# EAGLE schematic Logic PCB v14 (EAGLE 9.7.0)
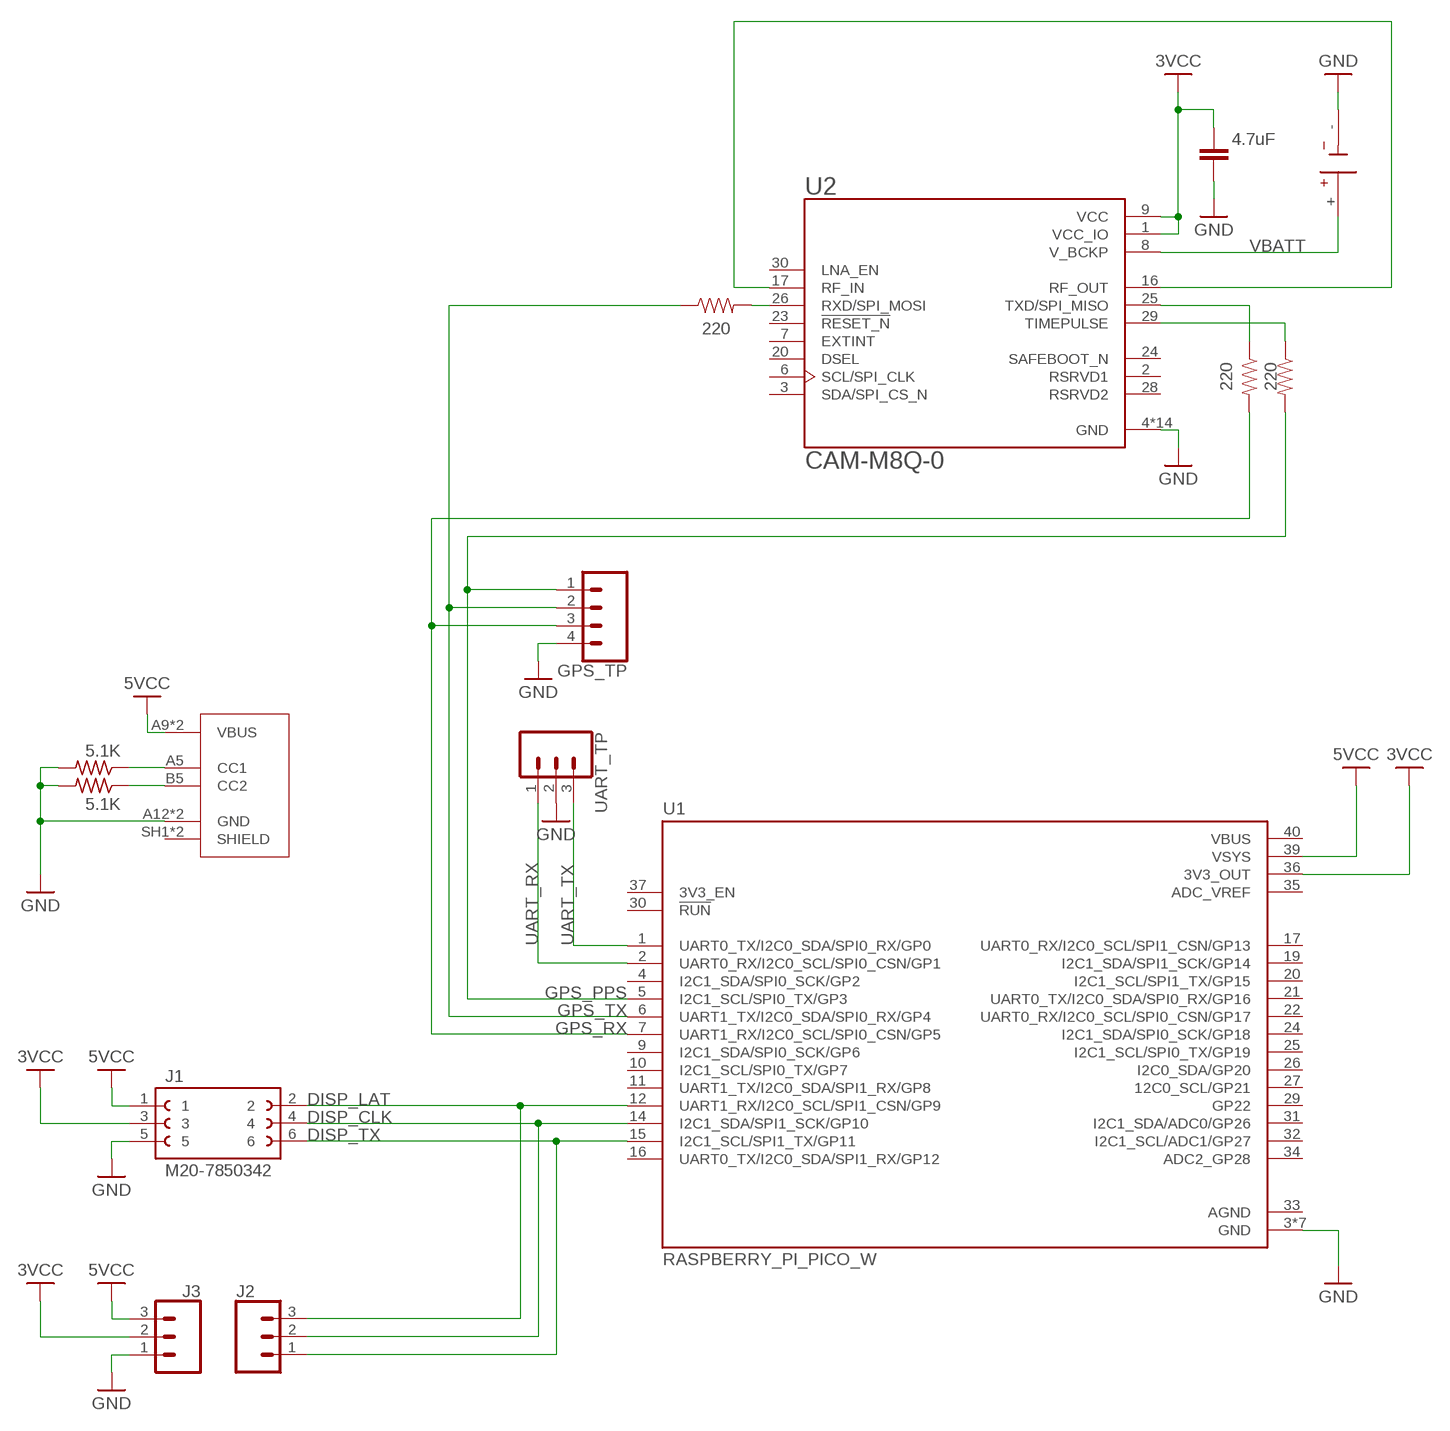
[diagram p0: schematic, sheet 1]

## Parts
BT1  BU2032SM-BT-GTR  [BAT_BU2032SM-BT-GTR]
C3  4.7uF  C_CHIP-0603(1608-METRIC)  [CAPC1608X85]
GPS_TP  CONN_04PTH  [1X04]
J1  M20-7850342  [HARWIN_M20-7850342]
J2  CONN_031X03_NO_SILK  [1X03_NO_SILK]
J3  CONN_031X03_NO_SILK  [1X03_NO_SILK]
R1  220  R-US_CHIP-0603(1608-METRIC)  [RESC1608X60]
R2  220  R-US_CHIP-0603(1608-METRIC)  [RESC1608X60]
R3  5.1K  R-US_CHIP-0603(1608-METRIC)  [RESC1608X60]
R4  5.1K  R-US_CHIP-0603(1608-METRIC)  [RESC1608X60]
R5  220  R-US_CHIP-0603(1608-METRIC)  [RESC1608X60]
U1  RASPBERRY_PI_PICO_W  [MODULE_RASPBERRY_PI_PICO_W]
U2  CAM-M8Q-0  [LCC100P960X1400X210-31N]
U$1  2171780001  [2171780001]
UART_TP  455-1750-1-ND  CONN_03  [1X03]

## Nets
3VCC: C3.1 J1.3 J3.2 U1.36(3V3_OUT) U2.1(VCC_IO) U2.9(VCC)
5VCC: J1.1 J3.3 U1.39(VSYS) U$1.A9(VBUS) U$1.B9(VBUS)
DISP_CLK: J1.4 J2.2 U1.14(I2C1_SDA/SPI1_SCK/GP10)
DISP_LAT: J1.2 J2.3 U1.12(UART1_RX/I2C0_SCL/SPI1_CSN/GP9)
DISP_TX: J1.6 J2.1 U1.15(I2C1_SCL/SPI1_TX/GP11)
GND: BT1.- C3.2 GPS_TP.4 J1.5 J3.1 R3.2 R4.2 U1.3(GND) U1.8(GND) U1.13(GND) U1.18(GND) U1.23(GND) U1.28(GND) U1.38(GND) U2.4(GND) U2.5(GND) U2.10(GND) U2.11(GND) U2.12(GND) U2.13(GND) U2.14(GND) U2.15(GND) U2.18(GND) U2.19(GND) U2.21(GND) U2.22(GND) U2.27(GND) U2.31(GND) U$1.A12(GND) U$1.B12(GND) UART_TP.2
GPS_PPS: GPS_TP.1 R2.2 U1.5(I2C1_SCL/SPI0_TX/GP3)
GPS_RX: GPS_TP.3 R5.2 U1.7(UART1_RX/I2C0_SCL/SPI0_CSN/GP5)
GPS_TX: GPS_TP.2 R1.1 U1.6(UART1_TX/I2C0_SDA/SPI0_RX/GP4)
N$1: R2.1 U2.29(TIMEPULSE)
N$2: R3.1 U$1.A5(CC1)
N$3: R4.1 U$1.B5(CC2)
N$5: U2.16(RF_OUT) U2.17(RF_IN)
N$7: R1.2 U2.26(RXD/SPI_MOSI)
N$12: R5.1 U2.25(TXD/SPI_MISO)
UART_RX: U1.2(UART0_RX/I2C0_SCL/SPI0_CSN/GP1) UART_TP.1
UART_TX: U1.1(UART0_TX/I2C0_SDA/SPI0_RX/GP0) UART_TP.3
VBATT: BT1.+ U2.8(V_BCKP)
Unconnected: U1.4(I2C1_SDA/SPI0_SCK/GP2) U1.9(I2C1_SDA/SPI0_SCK/GP6) U1.10(I2C1_SCL/SPI0_TX/GP7) U1.11(UART1_TX/I2C0_SDA/SPI1_RX/GP8) U1.16(UART0_TX/I2C0_SDA/SPI1_RX/GP12) U1.17(UART0_RX/I2C0_SCL/SPI1_CSN/GP13) U1.19(I2C1_SDA/SPI1_SCK/GP14) U1.20(I2C1_SCL/SPI1_TX/GP15) U1.21(UART0_TX/I2C0_SDA/SPI0_RX/GP16) U1.22(UART0_RX/I2C0_SCL/SPI0_CSN/GP17) U1.24(I2C1_SDA/SPI0_SCK/GP18) U1.25(I2C1_SCL/SPI0_TX/GP19) U1.26(I2C0_SDA/GP20) U1.27(12C0_SCL/GP21) U1.29(GP22) U1.30(!RUN) U1.31(I2C1_SDA/ADC0/GP26) U1.32(I2C1_SCL/ADC1/GP27) U1.34(ADC2_GP28) U1.37(3V3_EN) U2.2(RSRVD1) U2.3(SDA/SPI_CS_N) U2.6(SCL/SPI_CLK) U2.7(EXTINT) U2.20(DSEL) U2.23(!RESET_N) U2.24(SAFEBOOT_N) U2.28(RSRVD2) U2.30(LNA_EN) U$1.SH1(SHIELD) U$1.SH2(SHIELD)

## Power pins joined to a net without a drawn wire
ADC_VREF: U1.35(ADC_VREF)
AGND: U1.33(AGND)
VBUS: U1.40(VBUS)

## Library data of the parts
BT1 = SnapEDA Library:BU2032SM-BT-GTR; AVAILABILITY: Unavailable; DESCRIPTION: BATTERY HOLDER COIN 20MM SMD; MAXIMUM_PACKAGE_HEIGHT: 5.20mm; MF: MPD _Memory; MP: BU2032SM-HD-G; PACKAGE: None; PARTREV: F; PRICE: None
C3 = Capacitor:C: Capacitor - Generic; CATEGORY: Capacitor; PACKAGE_SIZE: 0603; PACKAGE_TYPE: SMD; SUBCATEGORY: Ceramic Capacitors; TYPE: MLCC
GPS_TP = SparkFun-Connectors:CONN_04: Multi connection point. Often used as Generic Header-pin footprint for 0.1 inch spaced/style header connections On any of the 0.1 inch spaced packages, you can populate with these: Break Away Headers - Straight <https://www.sparkfun.com/products/116> (PRT-00116) Break Away Male Headers - Right Angle <https://www.sparkfun.com/products/553> (PRT-00553) Female Headers <https://www.sparkfun.com/products/115> (PRT-00115) Break Away Headers - Machine Pin <https://www.sparkfun.com/products/117> (PRT-00117) Break Away Female Headers - Swiss Machine Pin <https://www.sparkfun.com/products/743> (PRT-00743) For SCREWTERMINALS and SPRING TERMINALS visit here: Screw Terimnals on SparkFun.com <https://www.sparkfun.com/search/results?term=Screw+Terminals> (5mm/3.5mm/2.54mm spacing) This device is also useful as a general connection point to wire up your design to another part of your project. Our various solder wires solder well into these plated through hole pads. Hook-Up Wire - Assortment (Stranded, 22 AWG) <https://www.sparkfun.com/products/11375> (PRT-11375) Hook-Up Wire - Assortment (Solid Core, 22 AWG) <https://www.sparkfun.com/products/11367> (PRT-11367) View the entire wire category on our website here <https://www.sparkfun.com/categories/141> Special notes: Molex polarized connector foot print use with SKU : PRT-08231 with associated crimp pins and housings. 1MM SMD Version SKU: PRT-10208; PROD_ID: CONN-09696
J1 = SnapEDA Library:M20-7850342; MANUFACTURER: Harwin; MAXIMUM_PACKAGE_HEIGHT: 5.15mm; PARTREV: 11; STANDARD: Manufacturer Recommendations
J2 J3 = SparkFun-Connectors:CONN_03: Multi connection point. Often used as Generic Header-pin footprint for 0.1 inch spaced/style header connections On any of the 0.1 inch spaced packages, you can populate with these: Break Away Headers - Straight <https://www.sparkfun.com/products/116> (PRT-00116) Break Away Male Headers - Right Angle <https://www.sparkfun.com/products/553> (PRT-00553) Female Headers <https://www.sparkfun.com/products/115> (PRT-00115) Break Away Headers - Machine Pin <https://www.sparkfun.com/products/117> (PRT-00117) Break Away Female Headers - Swiss Machine Pin <https://www.sparkfun.com/products/743> (PRT-00743) Stackable Header - 3 Pin (Female, 0.1") <https://www.sparkfun.com/products/13875> (PRT-13875) For SCREWTERMINALS and SPRING TERMINALS visit here: Screw Terimnals on SparkFun.com <https://www.sparkfun.com/search/results?term=Screw+Terminals> (5mm/3.5mm/2.54mm spacing) This device is also useful as a general connection point to wire up your design to another part of your project. Our various solder wires solder well into these plated through hole pads. Hook-Up Wire - Assortment (Stranded, 22 AWG) <https://www.sparkfun.com/products/11375> (PRT-11375) Hook-Up Wire - Assortment (Solid Core, 22 AWG) <https://www.sparkfun.com/products/11367> (PRT-11367) View the entire wire category on our website here <https://www.sparkfun.com/categories/141> Special notes: Molex polarized connector foot print use with SKU : PRT-08232 with associated crimp pins and housings.
R1 R2 R5 = Resistor:R-US: Resistor Fixed - ANSI; CATEGORY: Resistors; DESCRIPTION: Chip Resistor 1.60 X 0.82 X 0.60 mm body 0603(1608-METRIC) Package; PACKAGE_SIZE: 0603; PACKAGE_TYPE: SMD
R3 R4 = Tutorial - Fusion 360:R-US: Resistor Fixed - ANSI; CATEGORY: Resistor; SUB-CATEGORY: Fixed
U1 = SnapEDA Library:RASPBERRY_PI_PICO_W; MANUFACTURER: Raspberry Pi; PARTREV: 2.4; STANDARD: Manufacturer Recommendations
U2 = SnapEDA Library:CAM-M8Q-0; MANUFACTURER: UBlox
U$1 = GPS Clock Components:2171780001
UART_TP = SparkFun-Connectors:CONN_03: Multi connection point. Often used as Generic Header-pin footprint for 0.1 inch spaced/style header connections On any of the 0.1 inch spaced packages, you can populate with these: Break Away Headers - Straight <https://www.sparkfun.com/products/116> (PRT-00116) Break Away Male Headers - Right Angle <https://www.sparkfun.com/products/553> (PRT-00553) Female Headers <https://www.sparkfun.com/products/115> (PRT-00115) Break Away Headers - Machine Pin <https://www.sparkfun.com/products/117> (PRT-00117) Break Away Female Headers - Swiss Machine Pin <https://www.sparkfun.com/products/743> (PRT-00743) Stackable Header - 3 Pin (Female, 0.1") <https://www.sparkfun.com/products/13875> (PRT-13875) For SCREWTERMINALS and SPRING TERMINALS visit here: Screw Terimnals on SparkFun.com <https://www.sparkfun.com/search/results?term=Screw+Terminals> (5mm/3.5mm/2.54mm spacing) This device is also useful as a general connection point to wire up your design to another part of your project. Our various solder wires solder well into these plated through hole pads. Hook-Up Wire - Assortment (Stranded, 22 AWG) <https://www.sparkfun.com/products/11375> (PRT-11375) Hook-Up Wire - Assortment (Solid Core, 22 AWG) <https://www.sparkfun.com/products/11367> (PRT-11367) View the entire wire category on our website here <https://www.sparkfun.com/categories/141> Special notes: Molex polarized connector foot print use with SKU : PRT-08232 with associated crimp pins and housings.; PROD_ID: XXX-00000